# EAGLE schematic RAM-loader (EAGLE 9.6.2)
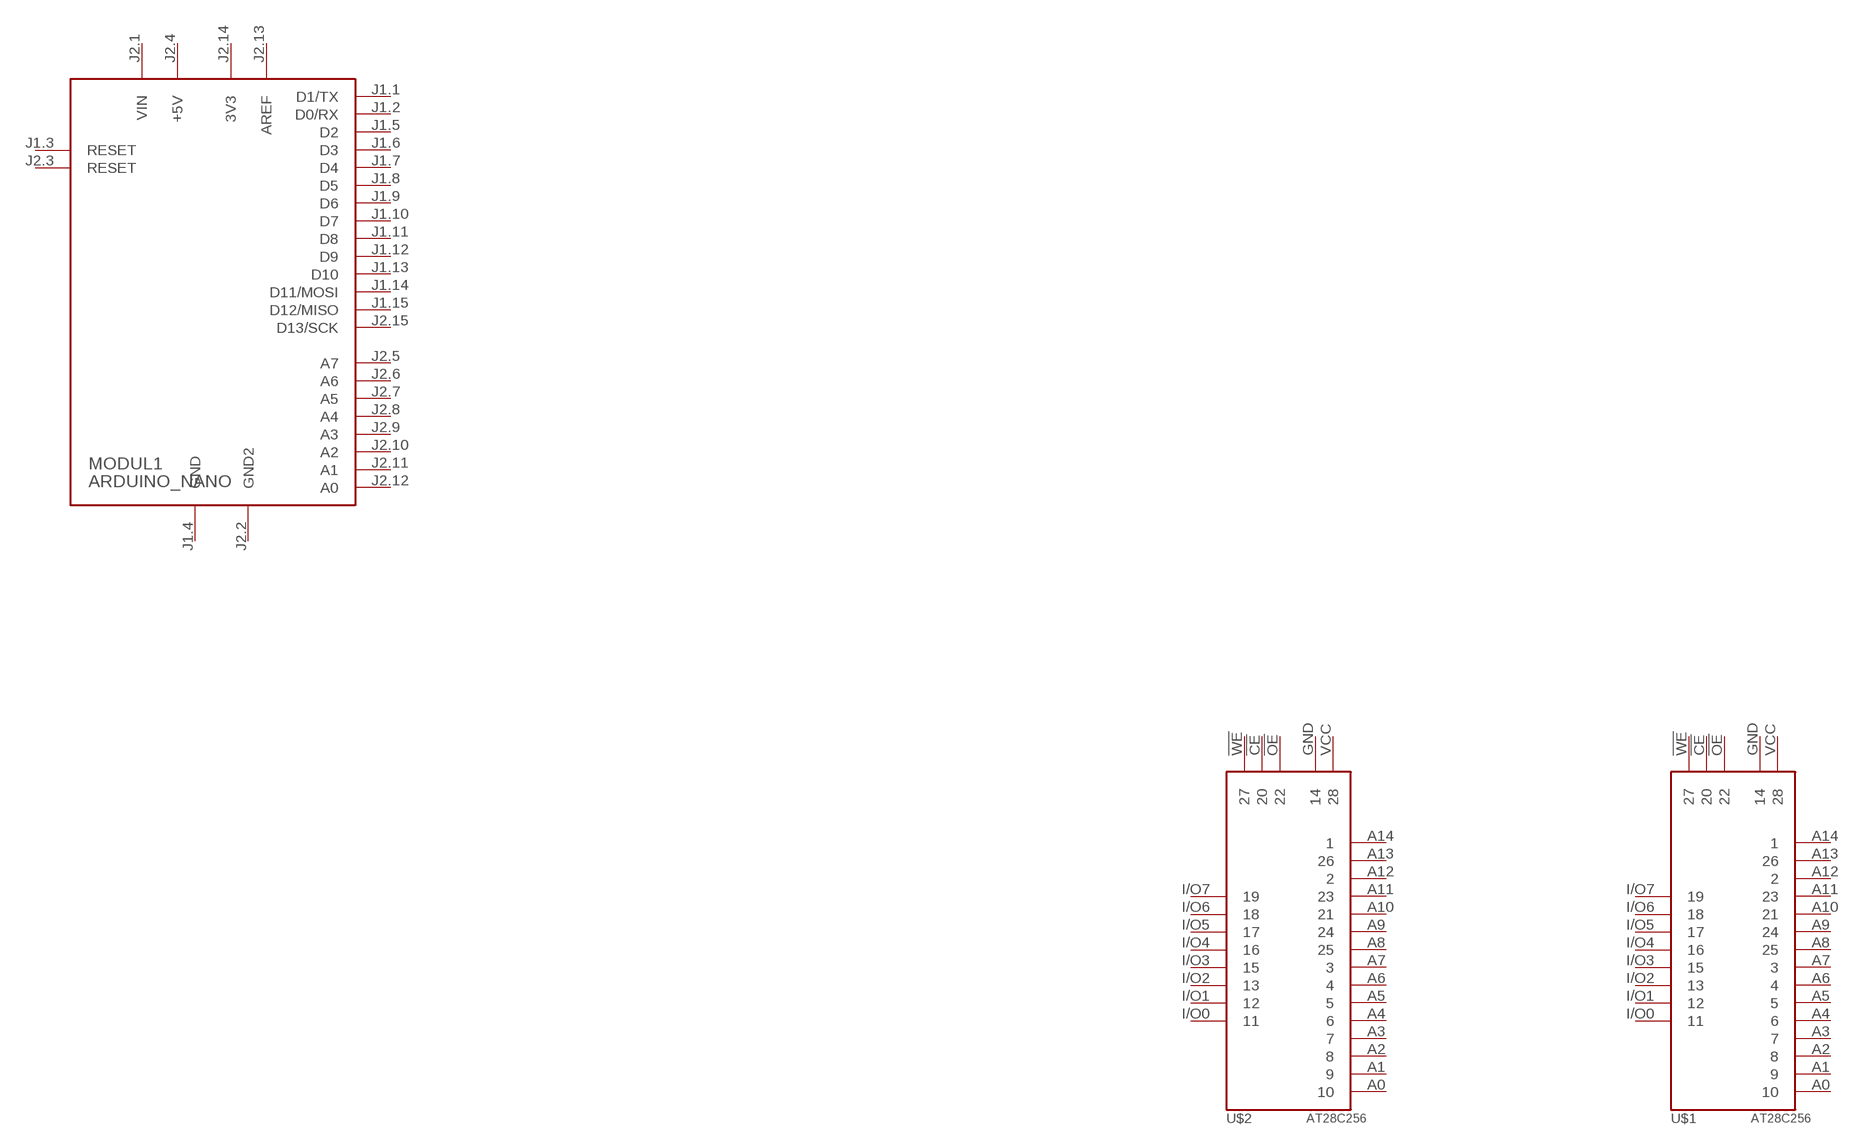
[diagram p0: schematic, sheet 1, part 1 of 2]
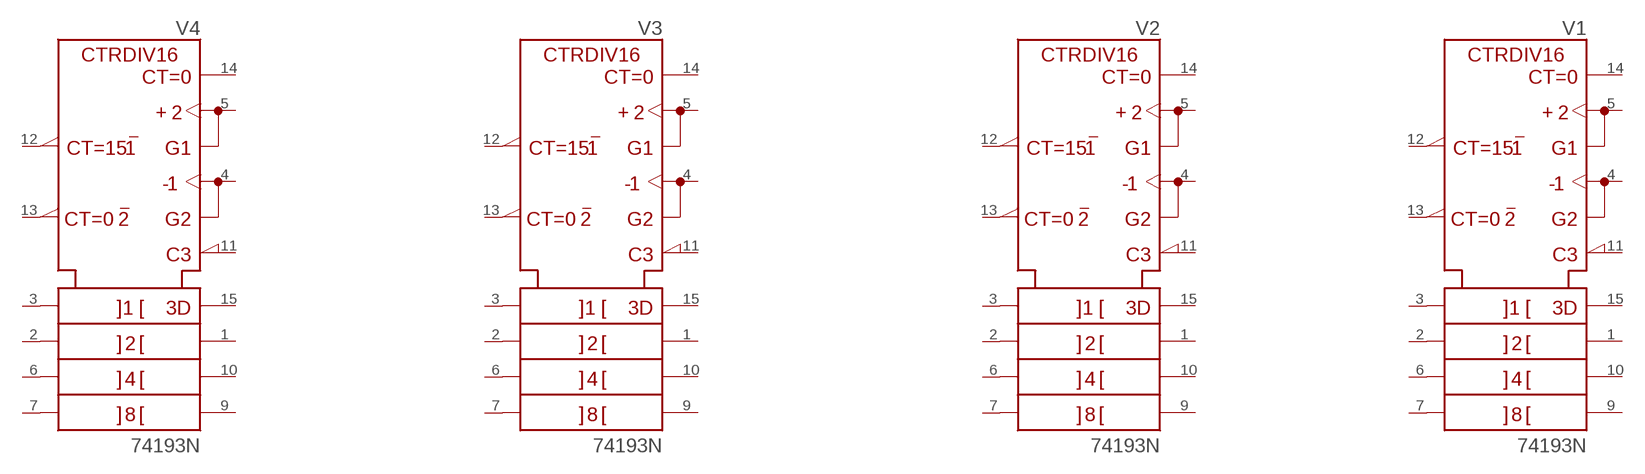
[diagram p1: schematic, sheet 1, part 2 of 2]

## Parts
MODUL1  ARDUINO_NANO  [ARDUINO_NANO2]
U$1  AT28C256  [AT28C256]
U$2  AT28C256  [AT28C256]
V1  74193N  [DIL16]
V2  74193N  [DIL16]
V3  74193N  [DIL16]
V4  74193N  [DIL16]
Unconnected: MODUL1.J1.1(D1/TX) MODUL1.J1.2(D0/RX) MODUL1.J1.3(RESET) MODUL1.J1.5(D2) MODUL1.J1.6(D3) MODUL1.J1.7(D4) MODUL1.J1.8(D5) MODUL1.J1.9(D6) MODUL1.J1.10(D7) MODUL1.J1.11(D8) MODUL1.J1.12(D9) MODUL1.J1.13(D10) MODUL1.J1.14(D11/MOSI) MODUL1.J1.15(D12/MISO) MODUL1.J2.3(RESET) MODUL1.J2.5(A7) MODUL1.J2.6(A6) MODUL1.J2.7(A5) MODUL1.J2.8(A4) MODUL1.J2.9(A3) MODUL1.J2.10(A2) MODUL1.J2.11(A1) MODUL1.J2.12(A0) MODUL1.J2.15(D13/SCK) U$1.!CE U$1.!OE U$1.!WE U$1.A0 U$1.A1 U$1.A2 U$1.A3 U$1.A4 U$1.A5 U$1.A6 U$1.A7 U$1.A8 U$1.A9 U$1.A10 U$1.A11 U$1.A12 U$1.A13 U$1.A14 U$1.GND U$1.I/O0 U$1.I/O1 U$1.I/O2 U$1.I/O3 U$1.I/O4 U$1.I/O5 U$1.I/O6 U$1.I/O7 U$1.VCC U$2.!CE U$2.!OE U$2.!WE U$2.A0 U$2.A1 U$2.A2 U$2.A3 U$2.A4 U$2.A5 U$2.A6 U$2.A7 U$2.A8 U$2.A9 U$2.A10 U$2.A11 U$2.A12 U$2.A13 U$2.A14 U$2.GND U$2.I/O0 U$2.I/O1 U$2.I/O2 U$2.I/O3 U$2.I/O4 U$2.I/O5 U$2.I/O6 U$2.I/O7 U$2.VCC V1.1(B) V1.2(QB) V1.3(QA) V1.4(DOWN) V1.5(UP) V1.6(QC) V1.7(QD) V1.9(D) V1.10(C) V1.11(!LOAD) V1.12(!CO) V1.13(!BO) V1.14(CLR) V1.15(A) V2.1(B) V2.2(QB) V2.3(QA) V2.4(DOWN) V2.5(UP) V2.6(QC) V2.7(QD) V2.9(D) V2.10(C) V2.11(!LOAD) V2.12(!CO) V2.13(!BO) V2.14(CLR) V2.15(A) V3.1(B) V3.2(QB) V3.3(QA) V3.4(DOWN) V3.5(UP) V3.6(QC) V3.7(QD) V3.9(D) V3.10(C) V3.11(!LOAD) V3.12(!CO) V3.13(!BO) V3.14(CLR) V3.15(A) V4.1(B) V4.2(QB) V4.3(QA) V4.4(DOWN) V4.5(UP) V4.6(QC) V4.7(QD) V4.9(D) V4.10(C) V4.11(!LOAD) V4.12(!CO) V4.13(!BO) V4.14(CLR) V4.15(A)

## Power pins joined to a net without a drawn wire
3V3: MODUL1.J2.14(3V3)
+5V: MODUL1.J2.4(+5V)
+UB: V1.16(+UB) V2.16(+UB) V3.16(+UB) V4.16(+UB)
-UB: V1.8(-UB) V2.8(-UB) V3.8(-UB) V4.8(-UB)
AREF: MODUL1.J2.13(AREF)
GND: MODUL1.J1.4(GND)
GND2: MODUL1.J2.2(GND2)
VIN: MODUL1.J2.1(VIN)

## Library data of the parts
MODUL1 = arduino:ARDUINO_NANO: Arduino Nano2 Auto generated by modulcreator.ulp \;; ANZAHL: 2; MODUL: TRUE; STECKX0: -76200; STECKX1: 76200; STECKY0: 177800; STECKY1: 177800
U$1 U$2 = Dargon's_lib:AT28C256
V1-V4 = 74ttl-din:74*193: Synchronus 4-bit up down COUNTER